# EAGLE design Codeshelf-0004.v02 (EAGLE 6.5.0)
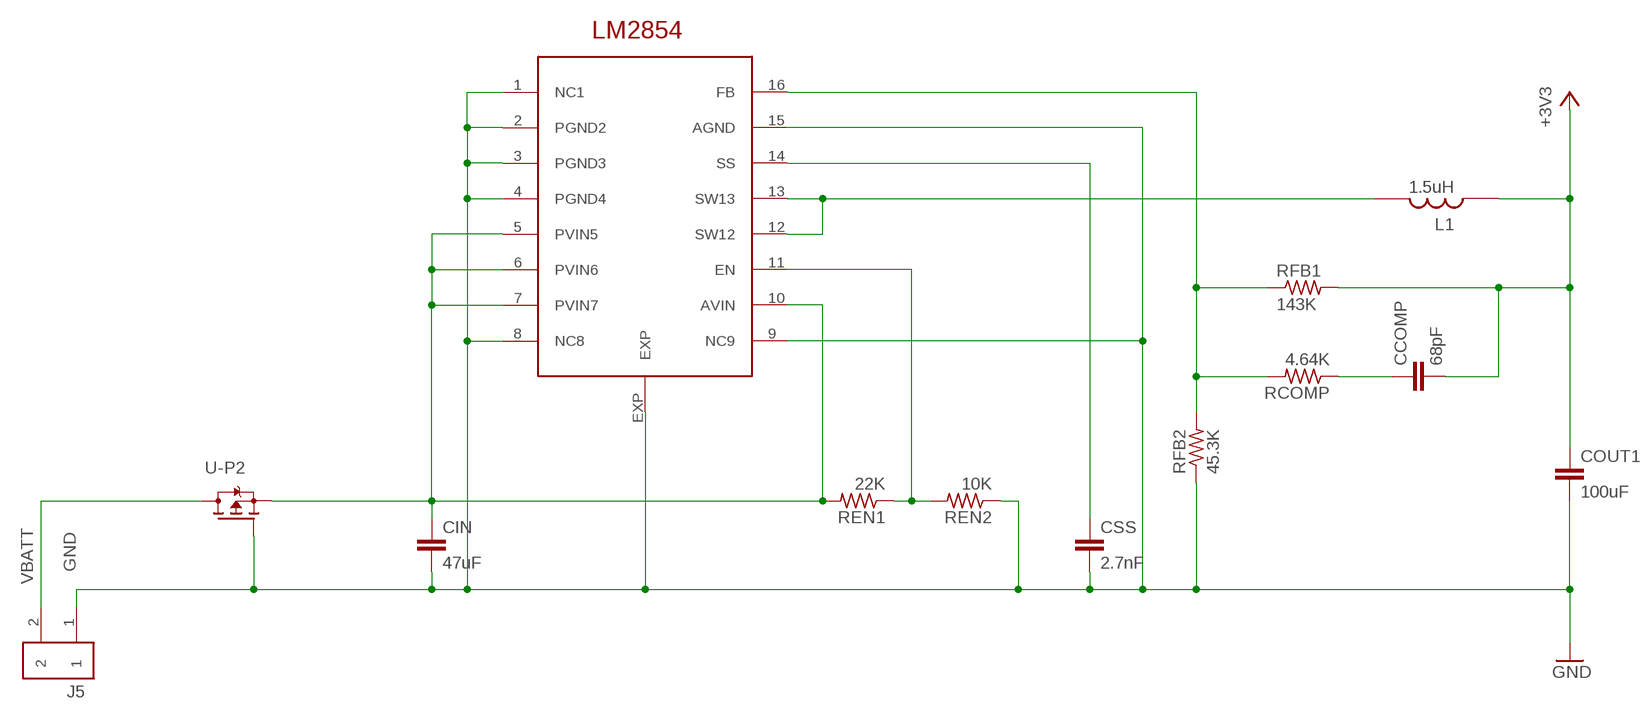
[diagram p0: schematic, sheet 1]

## Parts
CCOMP  68pF  RF-C0805  [C0805]
CIN  47uF  RF-C1210  [C1210K]
COUT1  100uF  RF-C1210  [C1210K]
CSS  2.7nF  RF-C0805  [C0805]
J5  HEADER-2X-2.54MM  [HEADER-2X-RA-2.54MM]
L1  1.5uH  INDUCTOR-SMD-UNUSUAL-SLF10165  [SLF10165]
RCOMP  4.64K  RF-R0402  [RF-R0402]
REN1  22K  RF-R0402  [RF-R0402]
REN2  10K  RF-R0402  [RF-R0402]
RFB1  143K  RF-R0402  [RF-R0402]
RFB2  45.3K  RF-R0402  [RF-R0402]
U-P1  LM2854MH  [HTSSOP16PWP]
U-P2  PCHANNEL-MOSFET-DPAK  [DPAK]

## Nets
+3V3 [3v3]: CCOMP.2 COUT1.1 L1.2 RFB1.2
GND [GND]: CIN.2 COUT1.2 CSS.2 J5.1 REN2.1 RFB2.1 U-P1.1(NC1) U-P1.2(PGND2) U-P1.3(PGND3) U-P1.4(PGND4) U-P1.8(NC8) U-P1.9(NC9) U-P1.15(AGND) U-P1.EXP U-P2.1(G)
N$22: CSS.1 U-P1.14(SS)
N$23: L1.1 U-P1.12(SW12) U-P1.13(SW13)
N$24: RCOMP.2 RFB1.1 RFB2.2 U-P1.16(FB)
N$25: CCOMP.1 RCOMP.1
N$26: REN1.1 REN2.2 U-P1.11(EN)
V-PROT: CIN.1 REN1.2 U-P1.5(PVIN5) U-P1.6(PVIN6) U-P1.7(PVIN7) U-P1.10(AVIN) U-P2.3(S)
VBATT: J5.2 U-P2.4(D)

## Library data of the parts
CCOMP = GW-devices:RF-C: RF capacitor pads for FSL reference design; MFGN: Yageo; MFGP: CC0805JRNPO9BN680; PRICE: 0.05
CIN = GW-devices:RF-C: RF capacitor pads for FSL reference design; MFGN: TDK; MFGP: C3225X5R1A476M250AC; PRICE: 1.03
COUT1 = GW-devices:RF-C: RF capacitor pads for FSL reference design; MFGN: TDK; MFGP: C3225X5R0J107M250AC; PRICE: 1.15
CSS = GW-devices:RF-C: RF capacitor pads for FSL reference design; MFGN: Yageo; MFGP: CC0805KRX7R9BB272; PRICE: 0.03
J5 = GW-devices:HEADER-2X: 2 position pin header
L1 = GW-devices:INDUCTOR-SMD-UNUSUAL; MFGN: TDK; MFGP: SLF10165T-1R5N6R83PF; PRICE: 1.23
RCOMP = GW-devices:RF-R: RF resistor pads for FSL reference design; MFGN: Vishay; MFGP: CRCW04024K64FKED; PRICE: 0.05
REN1 = GW-devices:RF-R: RF resistor pads for FSL reference design; MFGN: Panasonic; MFGP: ERJ-2GEJ223X; PRICE: 0.2
REN2 = GW-devices:RF-R: RF resistor pads for FSL reference design; MFGN: Panasonic; MFGP: ERJ-2GEJ103X; PRICE: 0.02
RFB1 = GW-devices:RF-R: RF resistor pads for FSL reference design; MFGN: Vishay; MFGP: CRCW0402143KFKED; PRICE: 0.05
RFB2 = GW-devices:RF-R: RF resistor pads for FSL reference design; MFGN: Vishay; MFGP: CRCW040245K3FKED; PRICE: 0.04
U-P1 = GW-devices:LM2854; MFGN: TI; MFGP: LM2854MH-1000/NOPB; PRICE: 4.72
U-P2 = GW-devices:PCHANNEL-MOSFET; MFGN: On Semi; MFGP: NTD20P06LT4G

## Net classes
1 3v3: width 0.6 mm
2 5V: width 0.6 mm
3 +3V3: width 0.6 mm
4 GND: width 0.6 mm
5 RS485: width 0.4 mm

## Board
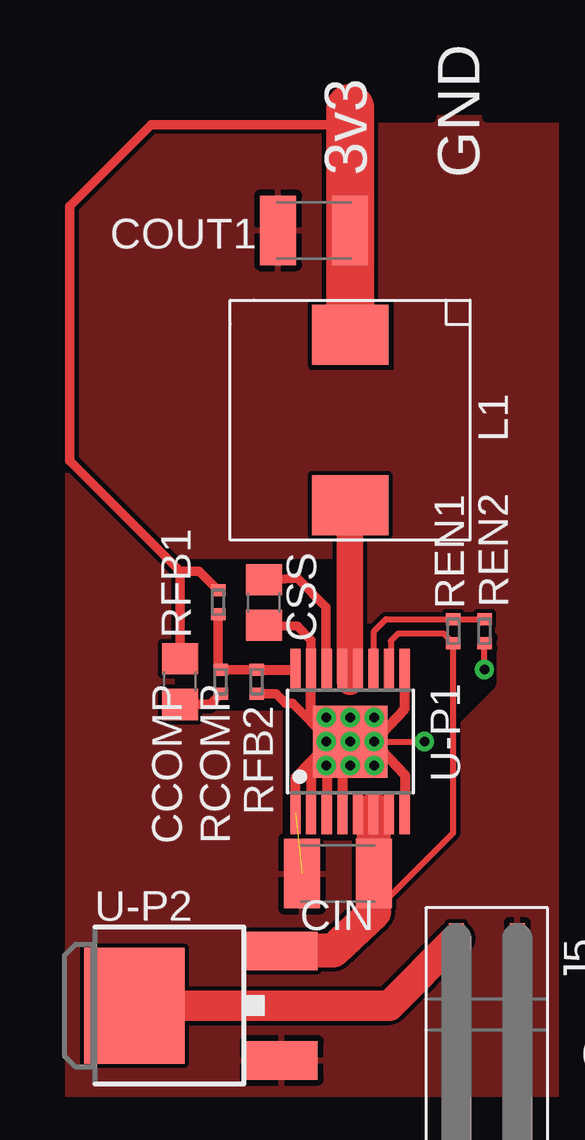
[diagram p1: board, top side]
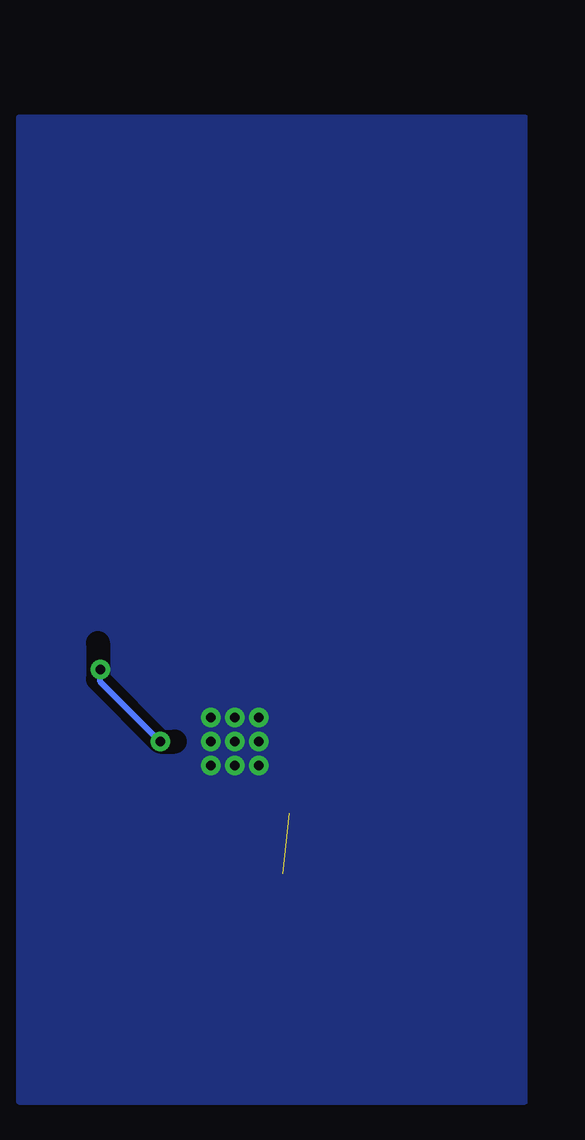
[diagram p2: board, bottom side, seen from below]

No outline drawn. Coordinates in mm, seen from the top.
Copper layers (1*16): Top 0.0356mm / dielectric 1.5011mm / Bottom 0.0356mm
Design rules "SilverCircuits": minimum track width 7mil, minimum drill 14mil, track to track 7mil, track to pad 7mil, pad to pad 7mil, via to via 7mil, smd to smd 0mil, copper to edge 20mil, drill to drill 8mil, minimum pad ring 10mil, minimum via ring 8mil, stop-mask expansion 4mil, vias tented up to drill 0mil, thermal gap 10mil
tRestrict: area 13,17.7 to 15.5,19.6; area 17.5,17.7 to 18.2,19.8; area 17.5,23.8 to 18.2,25.7; area 13.6,23.8 to 14.2,25.9; area 12.7,17.7 to 13.4,24.4; area 12.9,19.7 to 18.1,24.3; area 8.2,23.1 to 15,29.4; area 13.8,37.3 to 17.3,40.1; 18 lines
bRestrict: 3 lines

### Footprints (pad centres in the part's own frame; a part is rotated, then mirrored left to right if it is on the bottom)
C0805 = smd 1.3 x 1.5: 1 -0.95,0; 2 0.95,0
C1210K = smd 1.5 x 2.9: 1 -1.5,0; 2 1.5,0
HEADER-2X-RA-2.54MM = smd 1.27 x 0.635: 1 0,1.27; 2 0,-1.27
SLF10165 = smd 2.5 x 3.2: 1 -3.55,0; 2 3.55,0
RF-R0402 = smd 0.5 x 0.6: 1 -0.5,0; 2 0.5,0
HTSSOP16PWP = smd 0.42 x 1.78: 1 -2.275,-2.975; 2 -1.625,-2.975; 3 -0.975,-2.975; 4 -0.325,-2.975; 5 0.325,-2.975; 6 0.975,-2.975; 7 1.625,-2.975; 8 2.275,-2.975; 9 2.275,2.975; 10 1.625,2.975; 11 0.975,2.975; 12 0.325,2.975; 13 -0.325,2.975; 14 -0.975,2.975; 15 -1.625,2.975; 16 -2.275,2.975 | smd 3.1 x 3: EXP 0,0
DPAK = smd 1.6 x 3: 1 -2.28,-4.04; 3 2.28,-4.04 | smd 4.826 x 4.191: 4 0,2.096

### Placement (x,y rotation side)
CCOMP  8.4,24.3 90 top
CIN  15,16.3 180 top
COUT1  14,43.1 180 top
CSS  11.9,27.6 270 top
J5  21.2,13.6 270 top
L1  15.5,35.2 90 top
RCOMP  10.1,24.3 90 top
REN1  19.8,26.4 270 top
REN2  21.1,26.4 90 top
RFB1  10,27.6 90 top
RFB2  11.6,24.3 90 top
U-P1  15.5,21.8 0 top
U-P2  8.6,10.8 90 top

### Tracks (layer width: path | path; a pad name or v marks a point on that pad's centre or on a via)
+3V3
  Top 0.4: 15.5,47.4 15.4,47.5 7.2,47.5 3.8,44.1 3.8,33.5 8.4,28.9 | 8.4,28.9 CCOMP.2 | RFB1.2 9.2,28.9 8.4,28.9
  Top 0.406: 15.5,48.2 14.9,47.9
  Top 0.6: L1.2 14.7,38.5 | 15.5,48.2 15,48.6
  Top 1.27: 15.4,47.5 15.5,47.5
  Top 1.676: L1.2 COUT1.1 15.5,47.4 15.5,48.2
  Top 2: 15.5,48.2 15.5,38.7
GND  (via drill 0.4)  (1 unrouted)
  Top 0.25: v21.1,24.8 REN2.1 | v18.6,21.8 v16.5,21.8 U-P1.EXP
  Top 0.254: 14.53,20.8 v14.5,20.8 | v16.5,20.8 v15.5,20.8 U-P1.EXP | U-P1.EXP v15.5,22.8 | v15.5,22.8 v16.5,21.8 | v15.5,22.8 v16.5,22.8 | v15.5,22.8 v14.5,22.8 | U-P1.EXP v14.5,21.8 | U-P1.EXP 15.03,21.8 14.53,21.3
  Top 0.4: 13.88,24.5 13.88,26.02 13.3,26.6 CSS.2 | v14.5,21.8 14.5,22 | RFB2.1 12.4,23.8 12.8,23.4 13.1,23.4 13.88,22.62
  Top 0.406: U-P1.1 13.22,20.32 13.88,20.98 | 13.88,20.98 U-P1.2 | 13.88,20.98 14.53,21.62 | 14.53,21.62 14.53,21.3 14.53,20.8 U-P1.3 | 14.53,21.62 14.7,21.8 13.88,22.62 13.88,24.5 U-P1.15 | U-P1.4 15.18,21.48 U-P1.EXP | U-P1.8 17.77,20.43 v16.5,21.8 17.77,23.18 U-P1.9
  Bottom 0.25: v21.1,24.8 21.1,24.3 v18.6,21.8
  other vias: 15.5,21.8
  pour Bottom: 3.4,6.8 3.4,47.8 24.5,47.8 24.5,6.8
  pour Top: 3.4,6.8 3.4,47.8 24.5,47.8 24.5,6.8
N$22
  Top 0.4: CSS.1 13.3,28.6 14.5,27.4 14.5,24.8 U-P1.14
N$23
  Top 0.406: U-P1.12 U-P1.13 15.5,24.3
  Top 1.1: 15.5,24.3 L1.1
N$24
  Top 0.25: RCOMP.2 10,24.9
  Top 0.4: RCOMP.2 RFB2.2 | 10,24.9 RFB1.1
  Top 0.406: RFB2.2 13.2,24.8 U-P1.16
N$25
  Top 0.4: RCOMP.1 9.65,23.35 CCOMP.1
N$26
  Top 0.25: REN1.1 17,26.9 16.5,26.4 16.5,24.8
  Top 0.254: REN1.1 REN2.2 | U-P1.11 16.5,24.8
V-PROT
  Top 0.25: 17.2,24.85 17.2,26 17.5,26.3 19.4,26.3 REN1.2 19.8,18 16.5,14.7 | CIN.1 16.4,16.3 16.5,16.4
  Top 0.254: 17.2,24.85 U-P1.10
  Top 0.406: U-P1.6 U-P1.5 | 16.5,18.8 17.1,18.8 U-P1.7
  Top 1.422: 16.5,18.8 16.5,16.4 16.5,14.7 14.8,13.1 11.86,13.1 U-P2.3
  Top 1.676: 16.5,18.8 U-P1.6
VBATT
  Top 1.27: U-P2.4 17.13,10.8 J5.2

### Text on the board
tPlace: 3v3 | GND | BAT | GND